# EAGLE design integratedBertha (EAGLE 6.6.0)
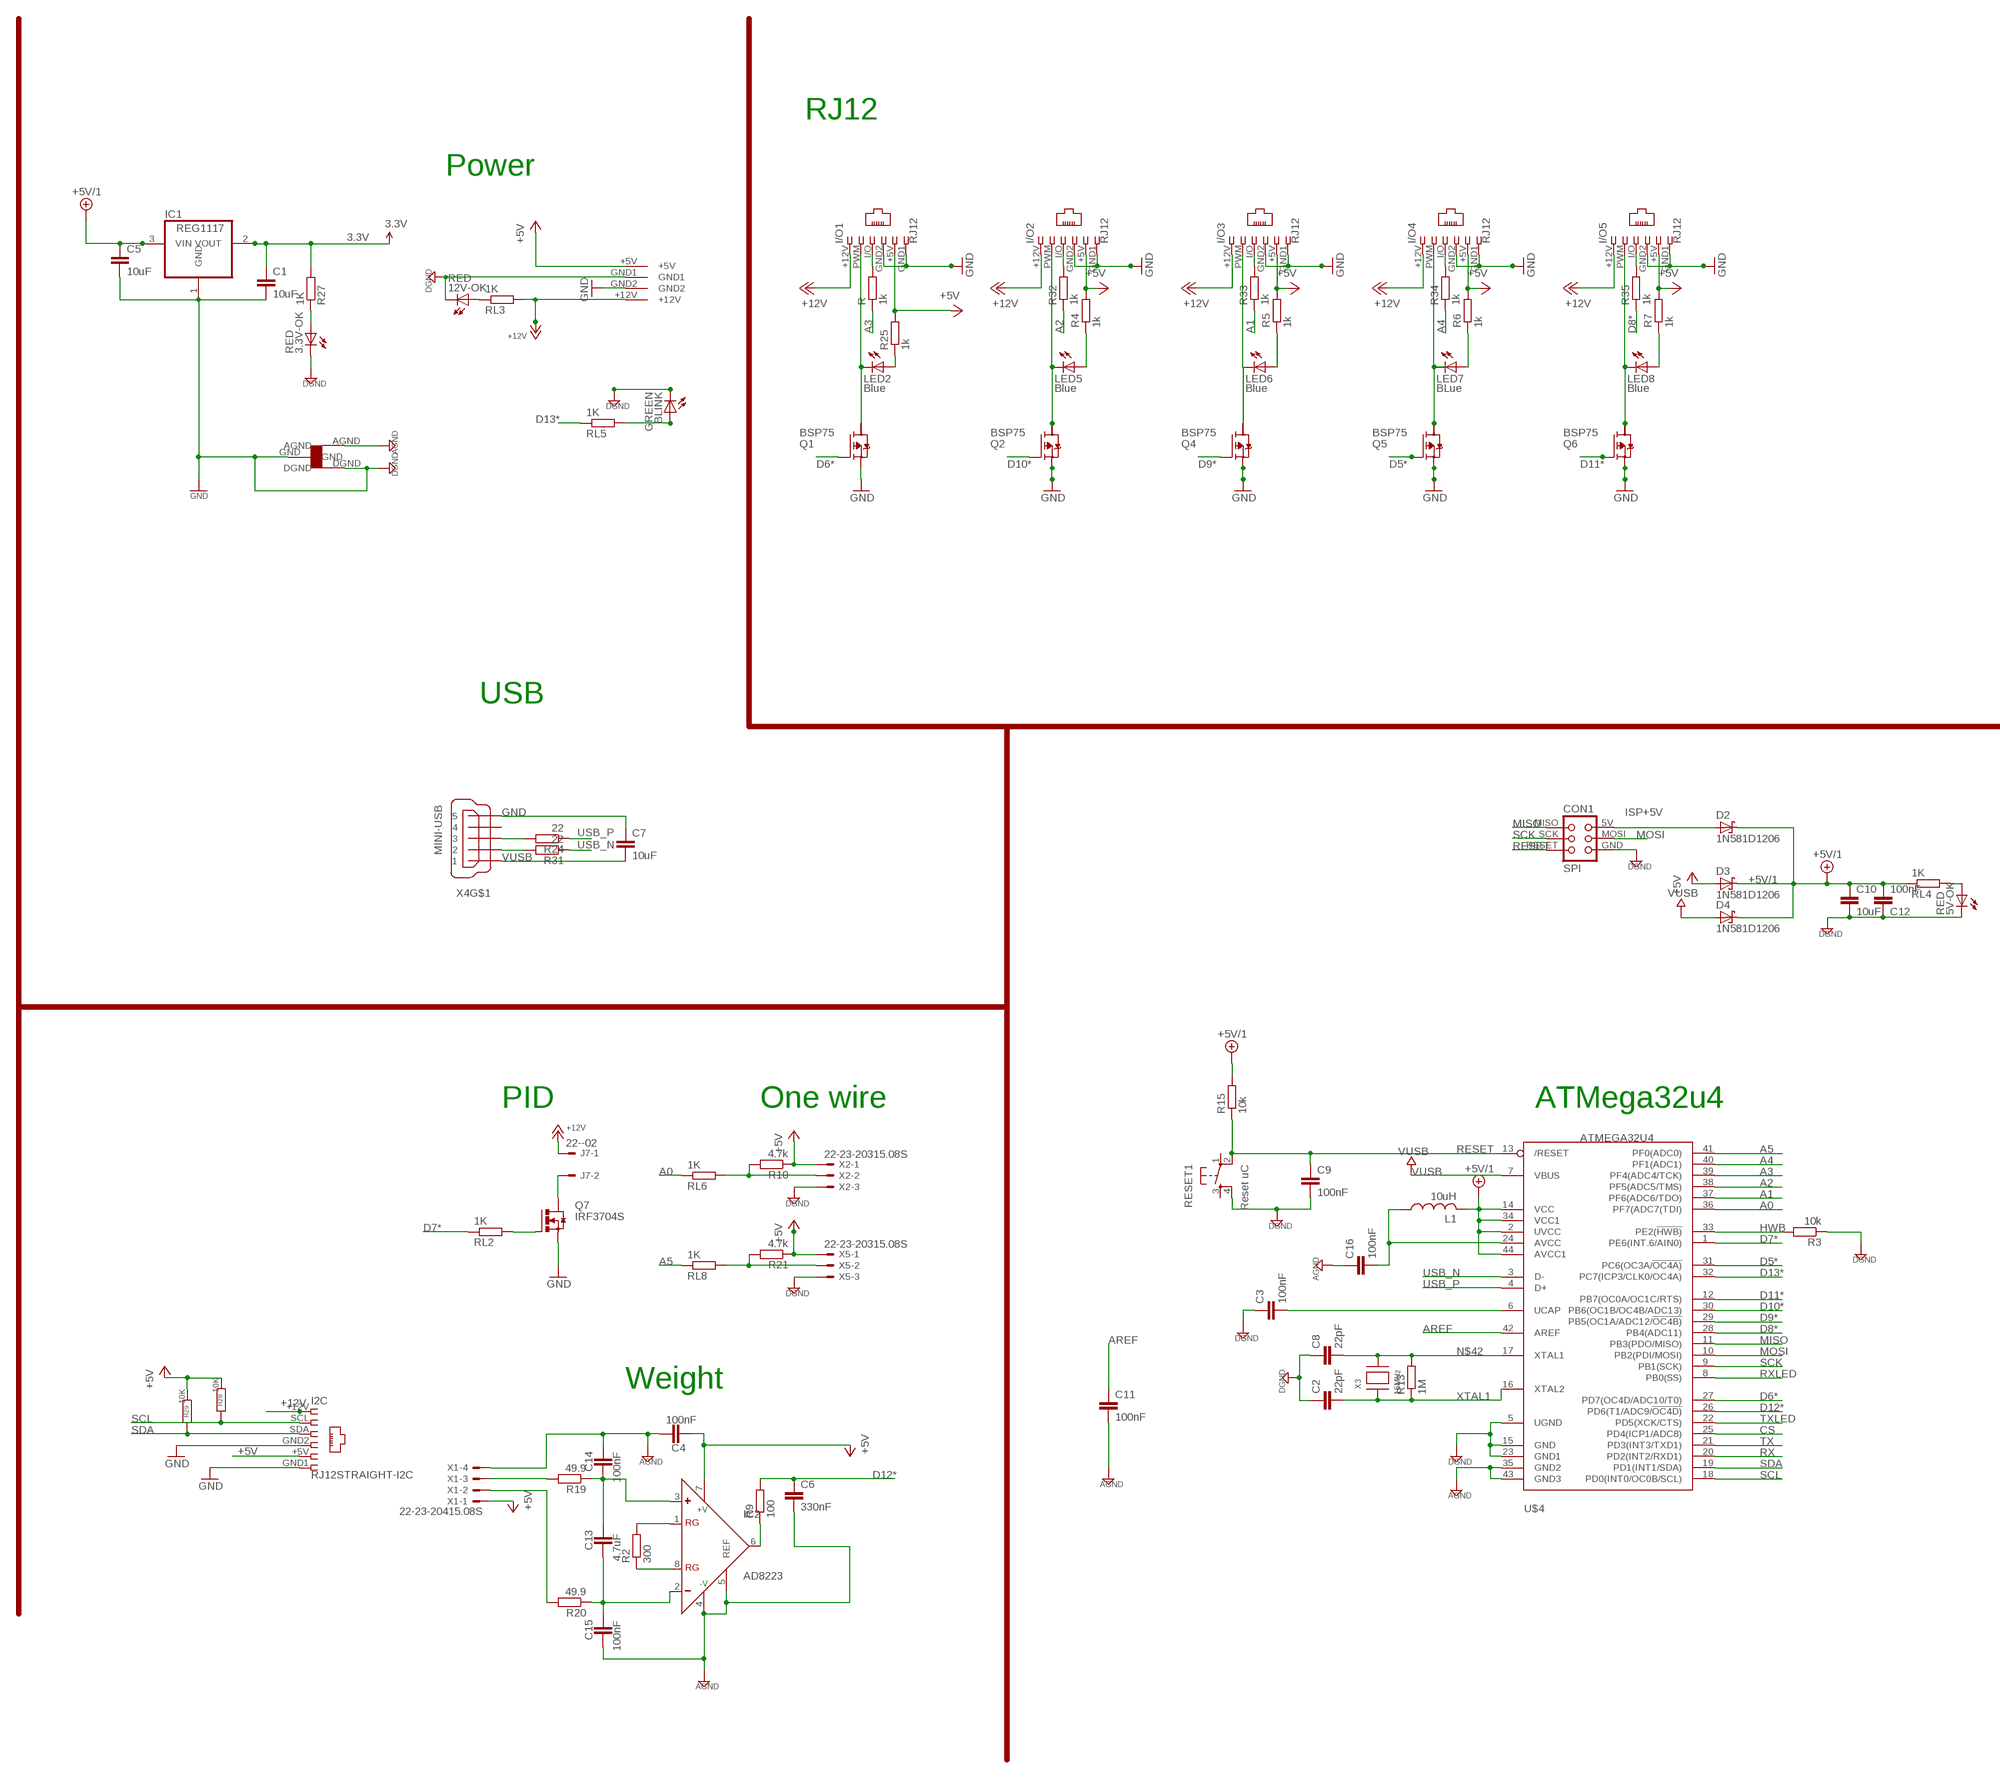
[diagram p0: schematic, sheet 1, part 1 of 2]
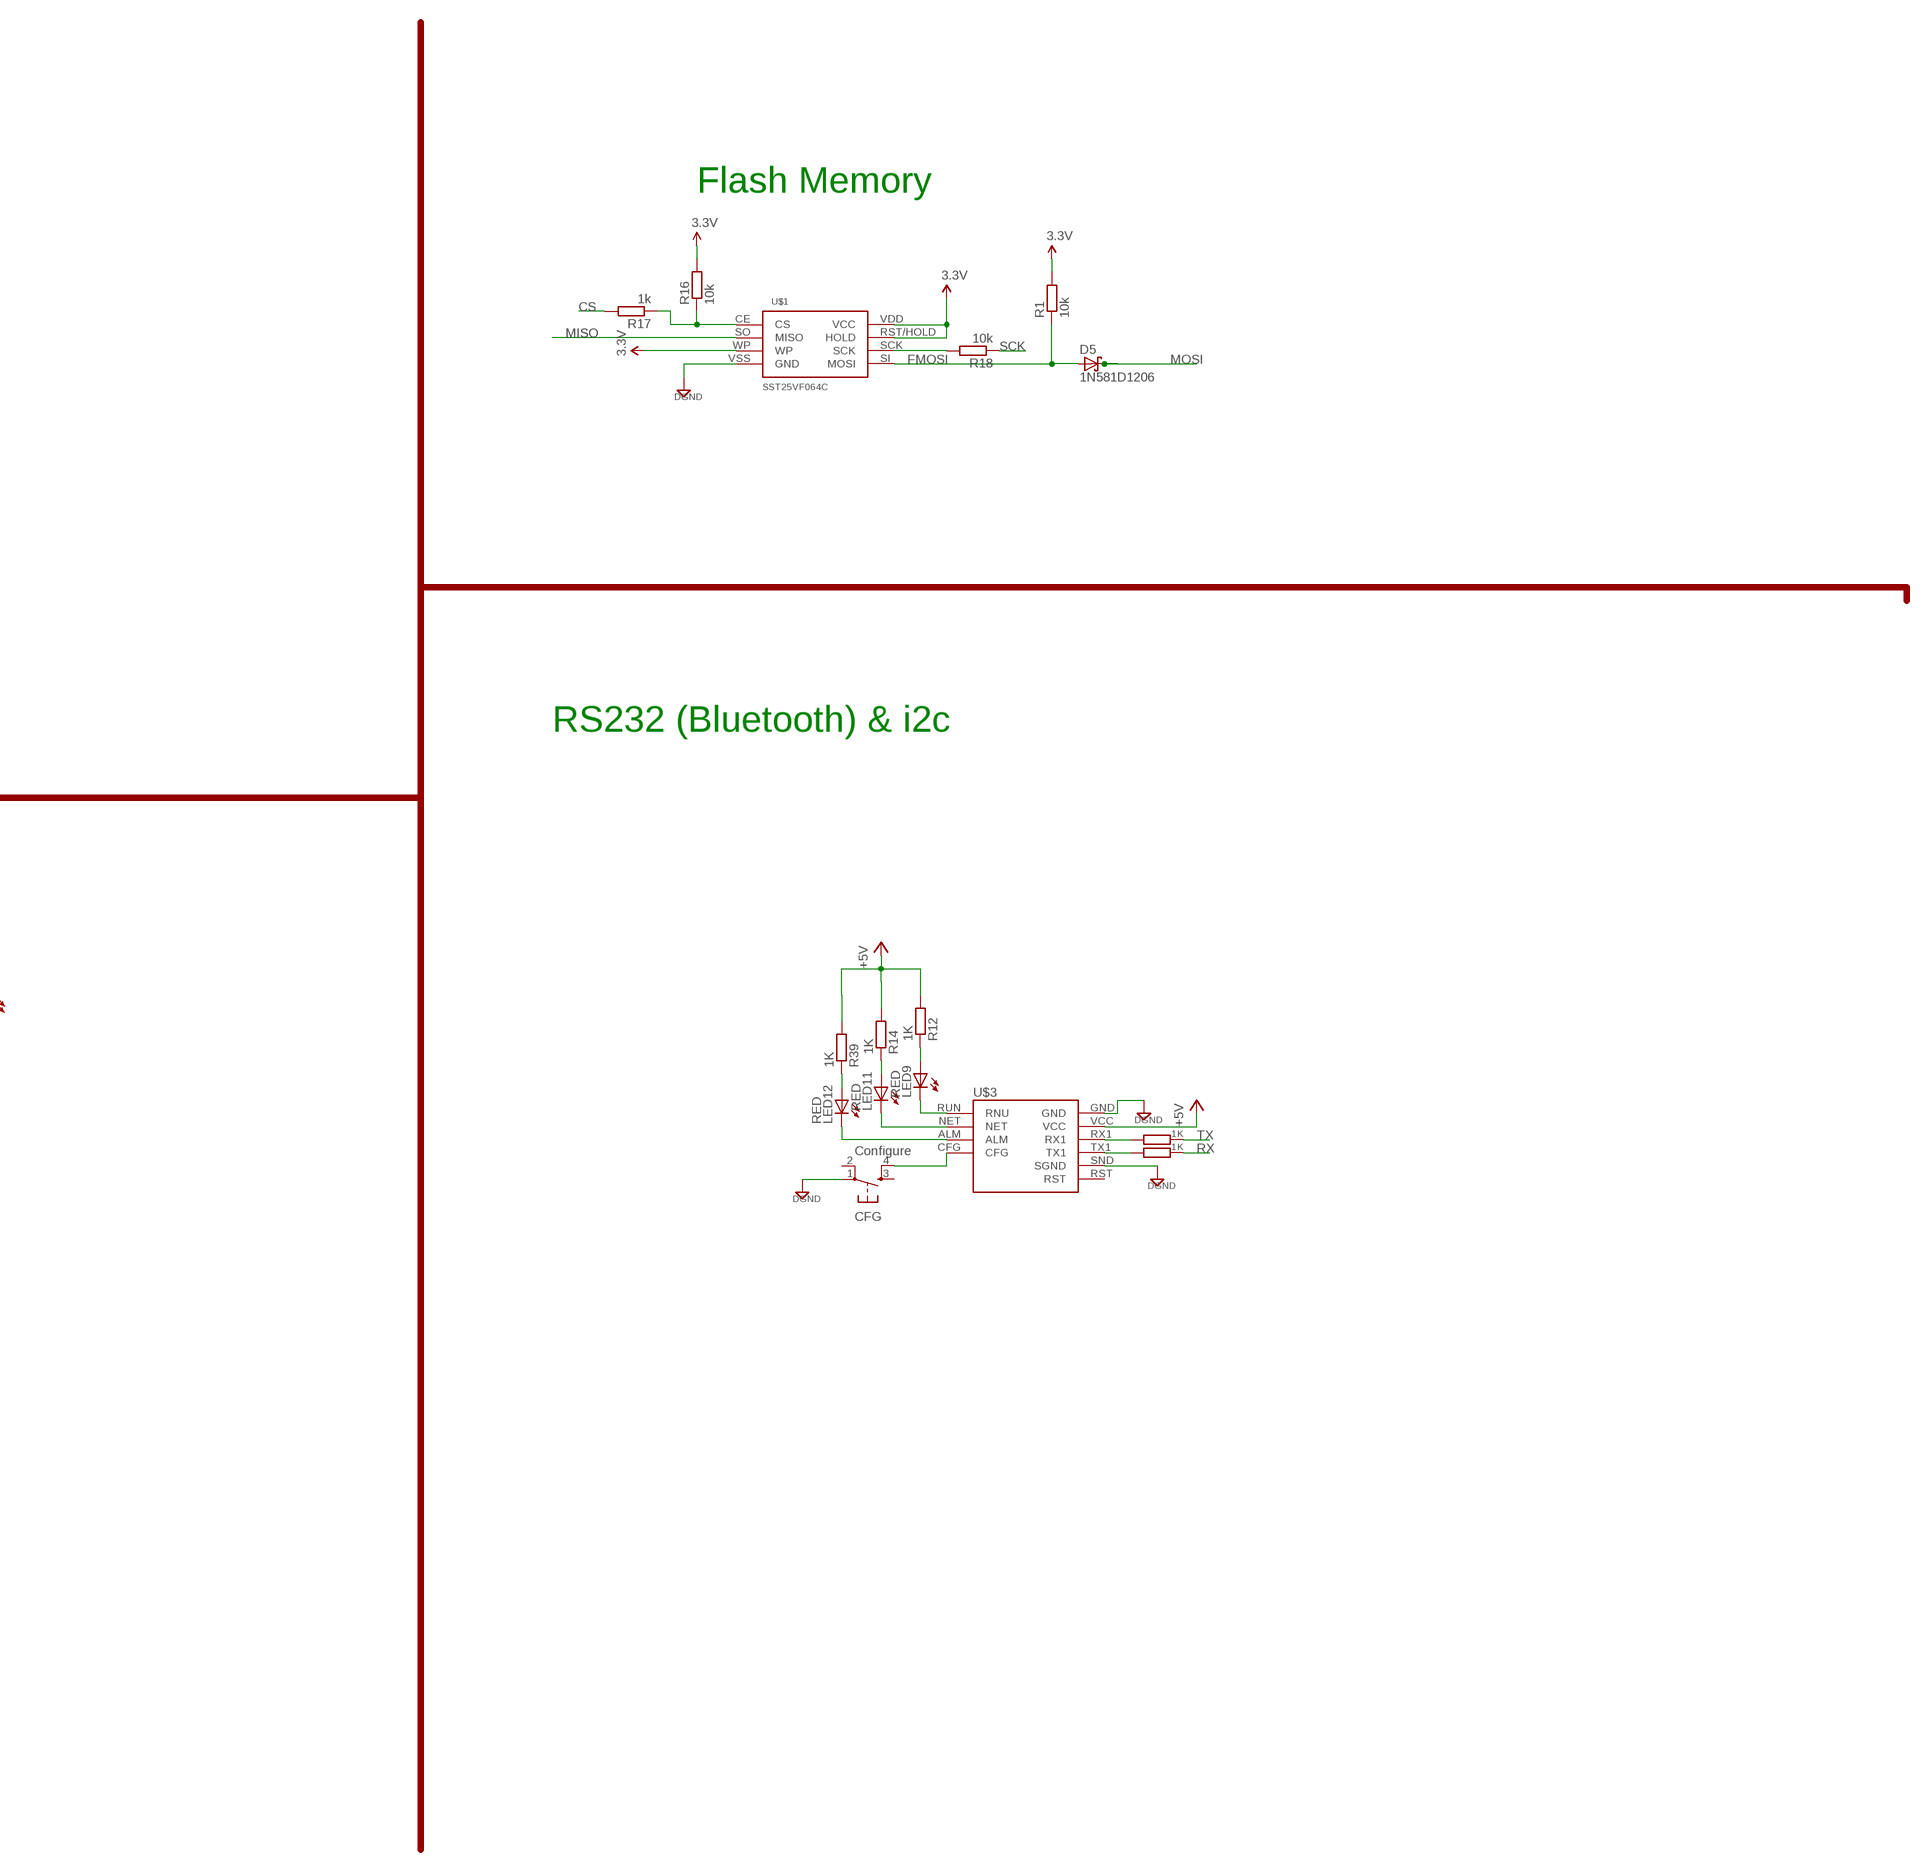
[diagram p1: schematic, sheet 1, part 2 of 2]

## Parts
3.3V-OK  RED  LEDCHIPLED_1206  [CHIPLED_1206]
5V-OK  RED  LEDCHIPLED_1206  [CHIPLED_1206]
12V-OK  RED  LEDCHIPLED_1206  [CHIPLED_1206]
BLINK  GREEN  LEDCHIPLED_1206  [CHIPLED_1206]
C1  10uF  C-EUC1206  [C1206]
C2  22pF  C-EUC1206  [C1206]
C3  100nF  C-EUC1206  [C1206]
C4  100nF  C-EUC1206  [C1206]
C5  10uF  C-EUC1206  [C1206]
C6  330nF  C-EUC1206  [C1206]
C7  10uF  C-EUC1206  [C1206]
C8  22pF  C-EUC1206  [C1206]
C9  100nF  C-EUC1206  [C1206]
C10  10uF  C-EUC1206  [C1206]
C11  100nF  C-EUC1206  [C1206]
C12  100nF  C-EUC1206  [C1206]
C13  4.7uF  C-EUC1206  [C1206]
C14  100nF  C-EUC1206  [C1206]
C15  100nF  C-EUC1206  [C1206]
C16  100nF  C-EUC1206  [C1206]
CFG  Configure  TAC_SWITCHSMD  [TACTILE_SWITCH_SMD]
CON1  SPI  TINYISPT  [TC2030-MCP-NL]
D2  1N581D1206  [LED-1206]
D3  1N581D1206  [LED-1206]
D4  1N581D1206  [LED-1206]
D5  1N581D1206  [LED-1206]
I2C  RJ12STRAIGHT-I2C  [RJ12-STRAIGHT-I2C]
I/O1  RJ12  RJ12STRAIGHT  [RJ12-STRAIGHT]
I/O2  RJ12  RJ12STRAIGHT  [RJ12-STRAIGHT]
I/O3  RJ12  RJ12STRAIGHT  [RJ12-STRAIGHT]
I/O4  RJ12  RJ12STRAIGHT  [RJ12-STRAIGHT]
I/O5  RJ12  RJ12STRAIGHT  [RJ12-STRAIGHT]
IC1  REG1117  [SOT223]
IC2  AD8223  AD620R  [SO8]
J7  22--02  [2-PIN-5.08S]
L1  10uH  L-USL2012C  [L2012C]
LED2  Blue  LEDCHIPLED_1206  [CHIPLED_1206]
LED5  Blue  LEDCHIPLED_1206  [CHIPLED_1206]
LED6  Blue  LEDCHIPLED_1206  [CHIPLED_1206]
LED7  BLue  LEDCHIPLED_1206  [CHIPLED_1206]
LED8  Blue  LEDCHIPLED_1206  [CHIPLED_1206]
LED9  RED  LEDCHIPLED_1206  [CHIPLED_1206]
LED11  RED  LEDCHIPLED_1206  [CHIPLED_1206]
LED12  RED  LEDCHIPLED_1206  [CHIPLED_1206]
Q1  BSP75  BSP613P  [PG-SOT-223]
Q2  BSP75  BSP613P  [PG-SOT-223]
Q4  BSP75  BSP613P  [PG-SOT-223]
Q5  BSP75  BSP613P  [PG-SOT-223]
Q6  BSP75  BSP613P  [PG-SOT-223]
Q7  IRF3704S  [D2PACK]
R  1k  R-EU_R0805  [R0805]
R1  10k  R-EU_R0805  [R0805]
R2  300  R-EU_R1206  [R1206]
R3  10k  R-EU_M0805  [M0805]
R4  1k  R-EU_R0805  [R0805]
R5  1k  R-EU_R0805  [R0805]
R6  1k  R-EU_R0805  [R0805]
R7  1k  R-EU_R0805  [R0805]
R8  1K  R-EU_R0805  [R0805]
R9  100  R-EU_R1206  [R1206]
R10  4.7k  R-EU_R1206  [R1206]
R11  1K  R-EU_R0805  [R0805]
R12  1K  R-EU_R0805  [R0805]
R13  1M  R-EU_R1206  [R1206]
R14  1K  R-EU_R0805  [R0805]
R15  10k  R-EU_M0805  [M0805]
R16  10k  R-EU_R0805  [R0805]
R17  1k  R-EU_R0805  [R0805]
R18  10k  R-EU_R0805  [R0805]
R19  49.9  R-EU_R1206  [R1206]
R20  49.9  R-EU_R1206  [R1206]
R21  4.7k  R-EU_R1206  [R1206]
R24  22  R-EU_M1206  [M1206]
R25  1k  R-EU_R0805  [R0805]
R27  1K  R-EU_R0805  [R0805]
R28  10K  R-EU_M0805  [M0805]
R29  10K  R-EU_M0805  [M0805]
R31  22  R-EU_M1206  [M1206]
R32  1k  R-EU_R0805  [R0805]
R33  1k  R-EU_R0805  [R0805]
R34  1k  R-EU_R0805  [R0805]
R35  1k  R-EU_R0805  [R0805]
R39  1K  R-EU_R0805  [R0805]
RESET1  Reset uC  TAC_SWITCHSMD  [TACTILE_SWITCH_SMD]
RL2  1K  R-EU_R0805  [R0805]
RL3  1K  R-EU_R0805  [R0805]
RL4  1K  R-EU_R0805  [R0805]
RL5  1K  R-EU_R0805  [R0805]
RL6  1K  R-EU_R0805  [R0805]
RL8  1K  R-EU_R0805  [R0805]
U$1  SST25VF064C  [SOIC_8-LEAD]
U$2  STARGND  [STAR]
U$3  SZ05-ZIGBEE  SZ05-ZIGBEETHROUGHHOLE  [SZ05-ZIGBEE4]
U$4  ATMEGA32U4  ATMEGA32U4-AU  [TQFP44]
U$6  KPJX-4S-S  [KPJX-4S-S]
X1  22-23-20415.08S  [4-PIN-5.08S]
X2  22-23-20315.08S  [3-PIN-5.08S]
X3  16MHz  XTALNX6035  [NX6035]
X4  MINI-USB  MINI-USB-SCHIELD-32005-201  [32005-201]
X5  22-23-20315.08S  [3-PIN-5.08S]

## Nets
3.3V [power]: C1.1 IC1.2(VOUT) R1.2 R16.2 R27.2 U$1.RST/HOLD(HOLD) U$1.VDD(VCC) U$1.WP
+5V [power]: C4.2 D3.A I2C.+5V I/O1.+5V I/O2.+5V I/O3.+5V I/O4.+5V I/O5.+5V IC2.7(+V) R4.2 R5.2 R6.2 R7.2 R10.1 R12.2 R14.2 R21.1 R25.2 R28.1 R29.1 R39.2 U$3.VCC U$6.+5V X1.1 X2.1 X5.1
+5V/1 [fine]: C5.1 C10.1 C12.2 D2.C D3.C D4.C IC1.3(VIN) L1.2 R15.2 RL4.1 U$4.2(UVCC) U$4.14(VCC) U$4.34(VCC1) U$4.44(AVCC1)
+12V [power]: I2C.+12V I/O1.+12V I/O2.+12V I/O3.+12V I/O4.+12V I/O5.+12V J7.1 RL3.2 U$6.+12V
A0: RL6.1 U$4.36(PF7(ADC7(TDI))
A1: R33.1 U$4.37(PF6(ADC6/TDO))
A2: R32.1 U$4.38(PF5(ADC5/TMS))
A3: R.1 U$4.39(PF4(ADC4/TCK))
A4: R34.1 U$4.40(PF1(ADC1))
A5: RL8.1 U$4.41(PF0(ADC0))
AGND: C4.1 C6.2 C11.2 C14.1 C15.2 C16.1 IC2.4(-V) IC2.5(REF) U$2.AGND U$4.35(GND2) U$4.43(GND3) X1.4
AREF: C11.1 U$4.42(AREF)
CS: R17.2 U$4.25(PD4(ICP1/ADC8))
D5*: Q5.1(G) U$4.31(PC6(OC3A/!OC4A))
D6*: Q1.1(G) U$4.27(PD7(OC4D/ADC10/T0))
D7*: RL2.1 U$4.1(PE6(INT.6/AIN0))
D8*: R35.1 U$4.28(PB4(ADC11))
D9*: Q4.1(G) U$4.29(PB5(OC1A/ADC12/!OC4B))
D10*: Q2.1(G) U$4.30(PB6(OC1B/OC4B/ADC13))
D11*: Q6.1(G) U$4.12(PB7(OC0A/OC1C/RTS))
D12*: C6.1 R9.2 U$4.26(PD6(T1/ADC9/!OC4D))
D13*: RL5.1 U$4.32(PC7(ICP3/CLK0/OC4A))
DIFF+: C13.1 C14.2 IC2.3(+) R19.1
DIFF-: C13.2 C15.1 IC2.2(-) R20.1
FMOSI: D5.A R1.1 U$1.SI(MOSI)
GND [power]: 3.3V-OK.C 5V-OK.C 12V-OK.C BLINK.C C1.2 C2.1 C3.1 C5.2 C7.1 C8.1 C9.2 C10.2 C12.1 CFG.1 CON1.GND I2C.GND1 I2C.GND2 I/O1.GND1 I/O1.GND2 I/O2.GND1 I/O2.GND2 I/O3.GND1 I/O3.GND2 I/O4.GND1 I/O4.GND2 I/O5.GND1 I/O5.GND2 IC1.1(GND) Q1.3(S) Q2.3(S) Q4.3(S) Q5.3(S) Q6.3(S) Q7.3(S) R3.1 RESET1.4 U$1.VSS(GND) U$2.DGND U$2.GND U$3.GND U$3.SND(SGND) U$4.5(UGND) U$4.15(GND) U$4.23(GND1) U$6.GND1 U$6.GND2 X2.3 X4.5 X5.3 ; supply symbol labelled DGND
GND1 [VIN]: LED9.C U$3.RUN(RNU)
GND2 [VIN]: LED11.C U$3.NET
GND3 [VIN]: LED12.C U$3.ALM
HWB: R3.2 U$4.33(PE2(!HWB))
ISP+5V: CON1.5V(VCC) D2.A
MISO: CON1.MISO U$1.SO(MISO) U$4.11(PB3(PDO/MISO))
MOSI: CON1.MOSI D5.C U$4.10(PB2(PDI/MOSI))
N$1: I/O3.PWM LED6.C Q4.2(D)
N$2: I/O2.I/O R32.2
N$3: BLINK.A RL5.2
N$4: LED5.A R4.1
N$5: I/O4.PWM LED7.C Q5.2(D)
N$6: Q7.1(G) RL2.2
N$7: I/O3.I/O R33.2
N$9 [power]: R21.2 RL8.2 X5.2
N$10: R16.1 R17.1 U$1.CE(CS)
N$11: R11.2 U$3.RX1
N$12: 5V-OK.A RL4.2
N$13: IC2.1(RG) R2.2
N$14 [fine]: C16.2 L1.1 U$4.24(AVCC)
N$15: IC2.8(RG) R2.1
N$16: C3.2 U$4.6(UCAP)
N$17: LED2.A R25.1
N$18: I/O1.I/O R.2
N$19: I/O5.PWM LED8.C Q6.2(D)
N$20: 3.3V-OK.A R27.1
N$21 [power]: R10.2 RL6.2 X2.2
N$22: LED6.A R5.1
N$23: R18.2 U$1.SCK
N$24: R8.2 U$3.TX1
N$25: LED9.A R12.1
N$26: LED11.A R14.1
N$27: LED12.A R39.1
N$28: I/O2.PWM LED5.C Q2.2(D)
N$29: I/O4.I/O R34.2
N$30: LED7.A R6.1
N$31: R20.2 X1.2
N$32: I/O5.I/O R35.2
N$33: LED8.A R7.1
N$34: I/O1.PWM LED2.C Q1.2(D)
N$35: CFG.4 U$3.CFG
N$36: J7.2 Q7.2(D)
N$37: R19.2 X1.3
N$40: IC2.6(OUT) R9.1
N$42: C8.2 R13.2 U$4.17(XTAL1) X3.P$2
N$75: 12V-OK.A RL3.1
RESET: C9.1 CON1.RESET R15.1 RESET1.2 U$4.13(/RESET)
RX: R8.1 U$4.20(PD2(INT2/RXD1))
RXLED: U$4.8(PB0(SS))
SCK: CON1.SCK R18.1 U$4.9(PB1(SCK))
SCL: I2C.SCL R28.2 U$4.18(PD0(INT0/OC0B/SCL))
SDA: I2C.SDA R29.2 U$4.19(PD1(INT1/SDA))
TX: R11.1 U$4.21(PD3(INT3/TXD1))
TXLED: U$4.22(PD5(XCK/CTS))
USB_N: R31.1 U$4.3(D-)
USB_P: R24.1 U$4.4(D+)
USBC_N: R31.2 X4.2
USBC_P: R24.2 X4.3
VUSB: C7.2 D4.A U$4.7(VBUS) X4.1
XTAL1: C2.2 R13.1 U$4.16(XTAL2) X3.P$1
Unconnected: CFG.2 CFG.3 Q1.4(D) Q2.4(D) Q4.4(D) Q5.4(D) Q6.4(D) RESET1.1 RESET1.3 U$3.RST X4.4 X4.M1(S:S1) X4.M2(S:S2) X4.M3(S:S3) X4.M4(S:S4)

## Notes on the sheet
- RJ12
- Power
- Flash Memory
- RS232 (Bluetooth) & i2c
- USB
- PID | One wire | ATMega32u4
- Weight

## Library data of the parts
3.3V-OK 5V-OK 12V-OK BLINK LED2 LED5-LED9 LED11 LED12 = adafruit:LED: LED OSRAM: - CHIPLED LG R971, LG N971, LY N971, LG Q971, LY Q971, LO R971, LY R971 LH N974, LH R974 LS Q976, LO Q976, LY Q976 LO Q996 - Hyper CHIPLED LW Q18S LB Q993, LB Q99A, LB R99A - SideLED LS A670, LO A670, LY A670, LG A670, LP A670 LB A673, LV A673, LT A673, LW A673 LH A674 LY A675 LS A676, LA A676, LO A676, LY A676, LW A676 LS A679, LY A679, LG A679 - Hyper Micro SIDELED® LS Y876, LA Y876, LO Y876, LY Y876 LT Y87S - SmartLED LW L88C, LW L88S LB L89C, LB L89S, LG L890 LS L89K, LO L89K, LY L89K LS L896, LA L896, LO L896, LY L896 - TOPLED LS T670, LO T670, LY T670, LG T670, LP T670 LSG T670, LSP T670, LSY T670, LOP T670, LYG T670 LG T671, LOG T671, LSG T671 LB T673, LV T673, LT T673, LW T673 LH T674 LS T676, LA T676, LO T676, LY T676, LB T676, LH T676, LSB T676, LW T676 LB T67C, LV T67C, LT T67C, LS T67K, LO T67K, LY T67K, LW E67C LS E67B, LA E67B, LO E67B, LY E67B, LB E67C, LV E67C, LT E67C LW T67C LS T679, LY T679, LG T679 LS T770, LO T770, LY T770, LG T770, LP T770 LB T773, LV T773, LT T773, LW T773 LH T774 LS E675, LA E675, LY E675, LS T675 LS T776, LA T776, LO T776, LY T776, LB T776 LHGB T686 LT T68C, LB T68C - Hyper Mini TOPLED® LB M676 - Mini TOPLED Santana® LG M470 LS M47K, LO M47K, LY M47K Source: http://www.osram.convergy.de/
C1-C16 = rcl:C-EU: CAPACITOR, European symbol
CFG RESET1 = lpatiny:TAC_SWITCH: Momentary Switch Button commonly used for reset or general input. Spark Fun Electronics SKU : COM-00097
CON1 = lpatiny:TINYISP: CONNECTOR
D2-D5 = lpatiny:1N581*: 1.0A SCHOTTKY BARRIER RECTIFIER Source: http://www.diodes.com/datasheets/ds23001.pdf
I2C I/O1-I/O5 = lpatiny:RJ12: CORCOM Modular RJ Jacks No Shield Source: www.tycoelectronics.com .. ENG_DS_1654001_1099_RJ_L_0507.pdf
IC1 = burr-brown:REG1117: 800mA and 1A Low Dropout (LDO) Positive Regulator 1.8V, 2.5V, 2.85V, 3.3V, 5V, and Adj; MPN: REG1117; OC_FARNELL: 1097566; OC_NEWARK: 14P6981
IC2 = analog-devices:AD620: Low Cost, Low Power, Instrumentation Amplifier Source: http://www.analog.com/UploadedFiles/Data_Sheets/37793330023930AD620_e.pdf; MPN: AD620AR; OC_FARNELL: 1464424; OC_NEWARK: 05F7109
J7 = lpatiny:22-?-02: CONNECTOR wire to board 2.54 mm (.1 inch) pitch header
L1 = rcl:L-US: INDUCTOR, American symbol
Q1 Q2 Q4-Q6 = infineon:BSP613P: SIPMOS (R) Small-Signal-Transistor P-Channel (2 Drain) Source: http://www.infineon.com/dgdl/BSP613P_Rev2.4.pdf; OC_FARNELL: unknown; OC_NEWARK: unknown
Q7 = transistor-power:IRF3704: SMPS MOSFET HEXFET® Power MOSFET Source: http://www.irf.com/product-info/datasheets/data/irf3704.pdf
R R1 R4-R8 R11-R14 R16-R18 R25 R27 R32-R35 R39 RL2 RL3 RL5 RL6 RL8 = rcl:R-EU_: RESISTOR, European symbol
R2 R3 R9 R10 R15 R19-R21 R24 R28 R29 R31 RL4 = resistor:R-EU_: RESISTOR, European symbol
U$1 = BertaLib:SST25VF064C
U$2 = lpatiny:STARGND
U$3 = lpatiny:SZ05-ZIGBEE
U$4 = adafruit:ATMEGA32U4: http://www.ladyada.net/library/eagle
U$6 = lpatiny:KPJX-4S-S
X1 = lpatiny:22-23-2041: .100" (2.54mm) Center Header - 4 Pin
X2 X5 = lpatiny:22-23-2031: .100" (2.54mm) Center Header - 3 Pin
X3 = lpatiny:XTAL: Low cost SMT crystals, no capacitors included http://www.ladyada.net/library/eagle
X4 = con-cypressindustries:MINI-USB-SCHIELD-: MINI USB-B Conector Source: www.cypressindustries.com; OC_FARNELL: unknown; OC_NEWARK: unknown

## Net classes
0 default: width 0.305 mm
1 power: width 0.457 mm
2 VIN: width 0.457 mm
3 fine: width 0.254 mm
4 aref: width 0.305 mm

## Board
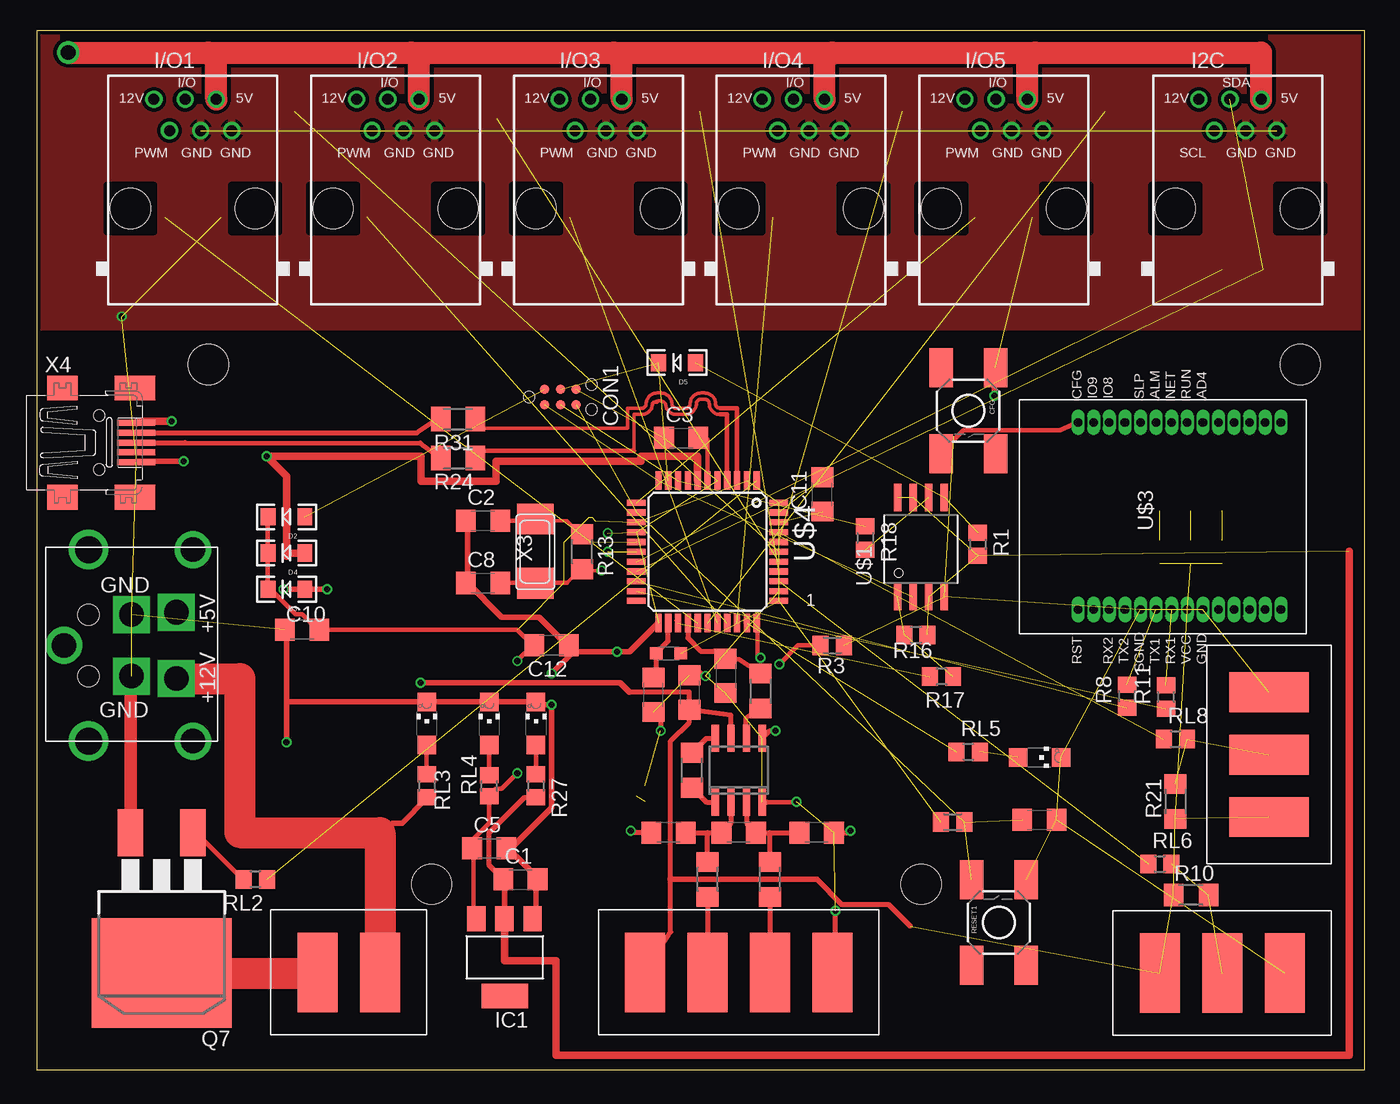
[diagram p2: board, top side]
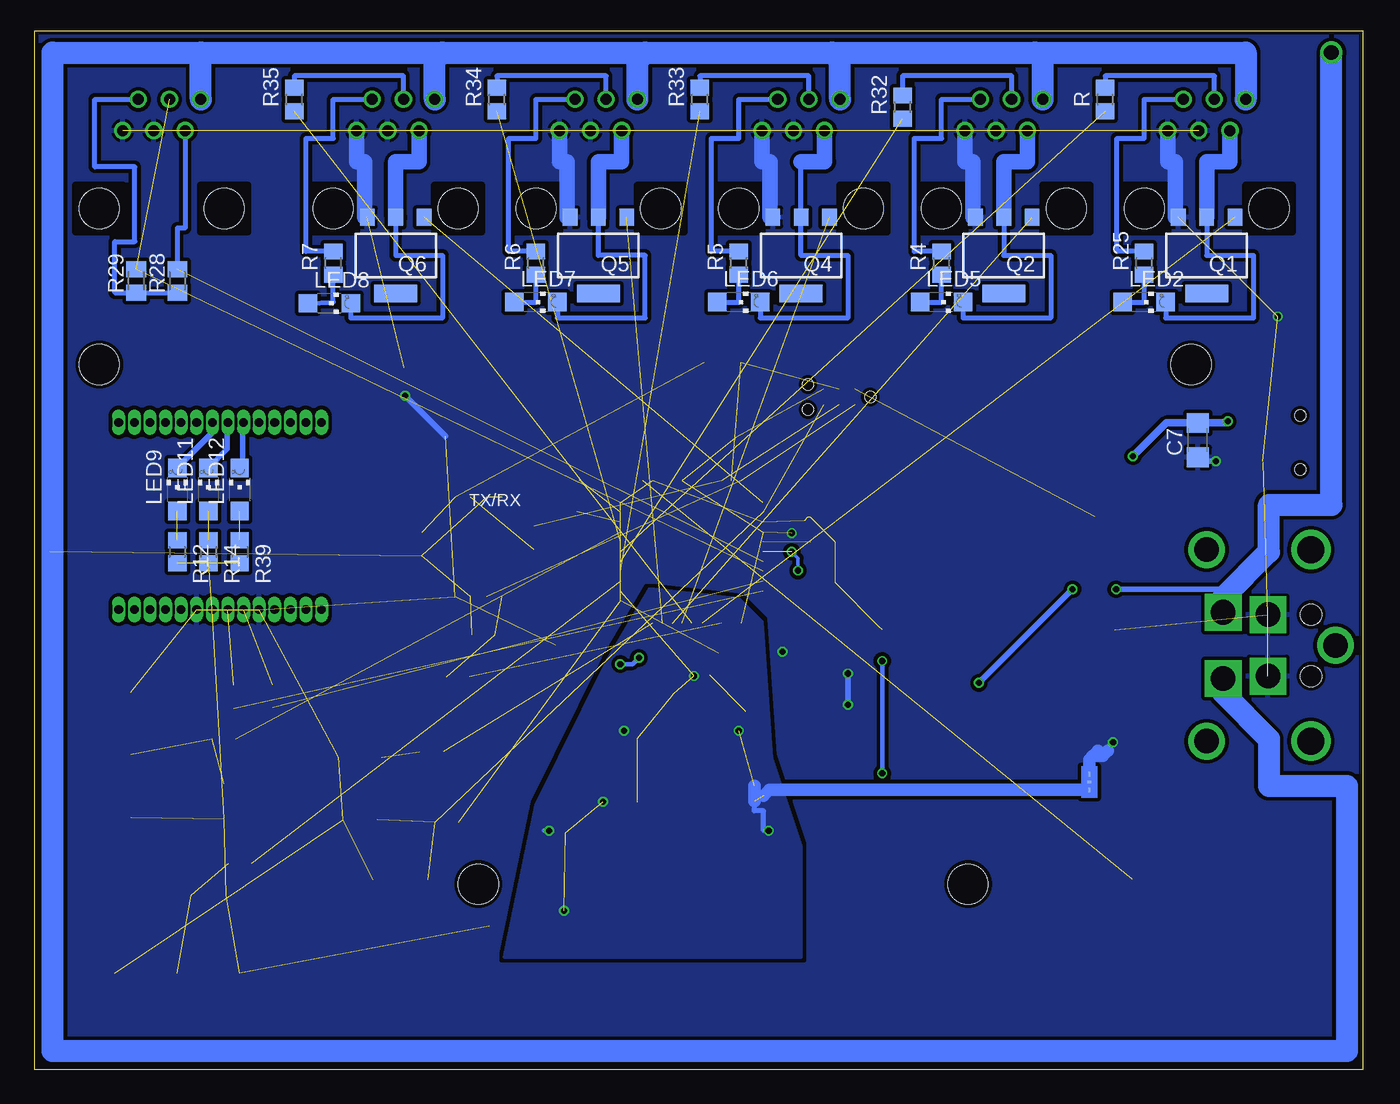
[diagram p3: board, bottom side, seen from below]

Size 108.13 x 84.57 mm. Coordinates in mm from the lower left corner, seen from the top.
Outline: 0,0 108.13,0 108.13,84.57 0,84.57 0,0
Copper layers (1*2*15*16): Top 0.035mm / dielectric 0.2mm / layer 2 0.0175mm / dielectric 1.1mm / layer 15 0.0175mm / dielectric 0.2mm / Bottom 0.035mm
Design rules "SeeedStudio_DRU_no_angle_20130527 *": minimum track width 6mil, minimum drill 0.5mm, track to track 7.5mil, track to pad 7.5mil, pad to pad 7.5mil, via to via 7.5mil, smd to smd 0mil, copper to edge 10mil, drill to drill 10mil, minimum pad ring 6mil, minimum via ring 6mil, stop-mask expansion 2mil, vias tented up to drill 25mil, thermal gap 10mil
Holes 3.25 mm at 13.97,57.4 102.87,57.4 32.13,15.11 72.01,15.11
vRestrict: area 47,34.5 to 62.2,38.4; area 47,35.8 to 50.8,49.8; area 58.4,37.1 to 62.2,49.8; area 47,46 to 62.2,49.8

### Footprints (pad centres in the part's own frame; a part is rotated, then mirrored left to right if it is on the bottom)
CHIPLED_1206 = smd 1.5 x 1.5: A 0,-1.75; C 0,1.75
C1206 = smd 1.6 x 1.8: 1 -1.4,0; 2 1.4,0
TACTILE_SWITCH_SMD = smd 3.175 x 1.905: 1 -3.493,2.223; 2 3.493,2.223; 3 -3.493,-2.223; 4 3.493,-2.223
TC2030-MCP-NL = smd 0.787 x 0.787: 5V 1.27,0.635; GND 3.81,0.635; MISO 1.27,-0.635; MOSI 2.54,0.635; RESET 3.81,-0.635; SCK 2.54,-0.635 | hole 0.889: 0,0; 5.08,-1.016; 5.08,1.016
LED-1206 = smd 1.2 x 1.4: A -1.5,0; C 1.5,0
RJ12-STRAIGHT-I2C = drill 0.9 pad 1.4: +5V 1.905,8.89; +12V -3.175,8.89; GND1 3.175,6.35; GND2 0.635,6.35; SCL -1.905,6.35; SDA -0.635,8.89 | hole 3.251: -5.08,0; 5.08,0
RJ12-STRAIGHT = drill 0.9 pad 1.4: +5V 1.905,8.89; +12V -3.175,8.89; GND1 3.175,6.35; GND2 0.635,6.35; I/O -0.635,8.89; PWM -1.905,6.35 | hole 3.251: -5.08,0; 5.08,0
SOT223 = smd 1.499 x 2.007: 1 -2.261,-3.15; 2 0.025,-3.15; 3 2.311,-3.15 | smd 3.81 x 2.007: 4 0,3.15
SO8 = smd 0.6 x 2.2: 1 -1.905,-2.6; 2 -0.635,-2.6; 3 0.635,-2.6; 4 1.905,-2.6; 5 1.905,2.6; 6 0.635,2.6; 7 -0.635,2.6; 8 -1.905,2.6
2-PIN-5.08S = smd 3.251 x 6.452: 1 -2.54,0; 2 2.54,0
L2012C = smd 1 x 1: 1 -1,0; 2 1,0
PG-SOT-223 = smd 1.2 x 1.4: 1 -2.311,-3.099; 2 0,-3.099; 3 2.311,-3.099 | smd 3.5 x 1.4: 4 0,3.099
D2PACK = smd 2.083 x 3.81: 1 -2.54,-8.89; 3 2.54,-8.89 | smd 11.43 x 8.89: 2 0,2.54
R0805 = smd 1.3 x 1.5: 1 -0.95,0; 2 0.95,0
R1206 = smd 1.6 x 1.803: 1 -1.422,0; 2 1.422,0
M0805 = smd 1.3 x 1.6: 1 -0.95,0; 2 0.95,0
M1206 = smd 1.6 x 2: 1 -1.4,0; 2 1.4,0
R0805' = smd 1.3 x 1.5: 1 -0.85,0; 2 0.85,0
SOIC_8-LEAD = smd 0.61 x 2.21: CE -1.905,-2.934; RST/HOLD -0.635,5.156; SCK 0.635,5.156; SI 1.905,5.156; SO -0.635,-2.934; VDD -1.905,5.156; VSS 1.905,-2.934; WP 0.635,-2.934
STAR = smd 0.152 x 0.305: AGND 0.635,-0.635; DGND 0.635,0.635 | smd 0.305 x 0.152: GND 0.635,0
SZ05-ZIGBEE4 = drill 0.7 pad 1.016 long: AD1 -6.985,6.35; AD2 -6.985,5.08; AD3 -6.985,3.81; AD4 -6.985,2.54; ALM -6.985,-1.27; C485 -6.985,-3.81; CFG -6.985,-7.62; GND 8.255,2.54; IO1 -6.985,8.89; IO2 -6.985,7.62; IO3 8.255,8.89; IO4 8.255,7.62; IO5 8.255,6.35; IO6 8.255,5.08; IO7 8.255,3.81; IO8 -6.985,-5.08; IO9 -6.985,-6.35; MS 8.255,-6.35; NET -6.985,0; RST 8.255,-7.62; RUN -6.985,1.27; RX1 8.255,0; RX2 8.255,-5.08; SLD -6.985,-2.54; SND 8.255,-2.54; TX1 8.255,-1.27; TX2 8.255,-3.81; VCC 8.255,1.27
TQFP44 = smd 1.5 x 0.5: 1 -5.8,4; 2 -5.8,3.2; 3 -5.8,2.4; 4 -5.8,1.6; 5 -5.8,0.8; 6 -5.8,0; 7 -5.8,-0.8; 8 -5.8,-1.6; 9 -5.8,-2.4; 10 -5.8,-3.2; 11 -5.8,-4; 23 5.8,-4; 24 5.8,-3.2; 25 5.8,-2.4; 26 5.8,-1.6; 27 5.8,-0.8; 28 5.8,0; 29 5.8,0.8; 30 5.8,1.6; 31 5.8,2.4; 32 5.8,3.2; 33 5.8,4 | smd 0.5 x 1.5: 12 -4,-5.8; 13 -3.2,-5.8; 14 -2.4,-5.8; 15 -1.6,-5.8; 16 -0.8,-5.8; 17 0,-5.8; 18 0.8,-5.8; 19 1.6,-5.8; 20 2.4,-5.8; 21 3.2,-5.8; 22 4,-5.8; 34 4,5.8; 35 3.2,5.8; 36 2.4,5.8; 37 1.6,5.8; 38 0.8,5.8; 39 0,5.8; 40 -0.8,5.8; 41 -1.6,5.8; 42 -2.4,5.8; 43 -3.2,5.8; 44 -4,5.8
KPJX-4S-S = drill 2 square: +5V 2.7,1.35; +12V -2.7,1.35; GND1 -2.5,5; GND2 2.5,5 | drill 2: P$1 -7.8,0; P$2 7.8,0; P$11 0,10.5 | drill 2.2: P$3 -7.8,8.5; P$4 7.8,8.5 | hole 1.7: -2.5,8.5; 2.5,8.5
4-PIN-5.08S = smd 3.251 x 6.452: 1 -7.62,0; 2 -2.54,0; 3 2.54,0; 4 7.62,0
3-PIN-5.08S = smd 3.251 x 6.452: 1 -5.08,0; 2 0,0; 3 5.08,0
NX6035 = smd 2.5 x 3: P$1 2.665,0; P$2 -2.565,0
32005-201 = smd 3.1 x 0.5: 1 3,1.6; 2 3,0.8; 3 3,0; 4 3,-0.8; 5 3,-1.6 | smd 2.5 x 2: M1 -3,-4.45; M2 -3,4.45 | smd 3.3 x 2: M3 2.9,4.45; M4 2.9,-4.45 | hole 0.9: 0,2.2; 0,-2.2

### Placement (x,y rotation side)
3.3V-OK  40.64,28.19 0 top
5V-OK  36.83,28.19 0 top
12V-OK  31.75,28.19 0 top
BLINK  81.64,25.43 270 top
C1  39.37,15.49 0 top
C2  36.32,44.7 0 top
C3  52.46,51.43 0 top
C4  53.14,30.71 270 top
C5  36.83,18.03 0 top
C6  56.08,32.05 270 top
C7  13.41,51.26 90 bottom
C8  36.32,39.62 0 top
C9  81.64,20.35 0 top
C10  21.59,35.81 180 top
C11  63.96,46.84 90 top
C12  41.91,34.54 180 top
C13  57.15,19.3 180 top
C14  63.5,19.3 180 top
C15  51.44,19.3 180 top
C16  50.22,30.53 90 top
CFG  75.84,53.64 270 top
CON1  40.08,54.76 0 top
D2  20.32,45.01 180 top
D3  20.32,39.12 180 top
D4  20.32,42.06 180 top
D5  52.12,57.56 180 top
I2C  97.79,70.1 0 top
I/O1  12.7,70.1 0 top
I/O2  29.21,70.1 0 top
I/O3  45.72,70.1 0 top
I/O4  62.23,70.1 0 top
I/O5  78.74,70.1 0 top
IC1  38.1,9.14 180 top
IC2  57.15,24.38 0 top
J7  25.4,7.92 180 top
L1  51.44,33.91 0 top
LED2  17.78,62.48 270 bottom
LED5  34.29,62.48 270 bottom
LED6  50.8,62.48 270 bottom
LED7  67.31,62.48 270 bottom
LED8  84.14,62.4 270 bottom
LED9  96.52,47.24 0 bottom
LED11  93.98,47.24 0 bottom
LED12  91.44,47.24 0 bottom
Q1  12.7,66.29 180 bottom
Q2  29.21,66.29 180 bottom
Q4  45.72,66.29 180 bottom
Q5  62.23,66.29 180 bottom
Q6  78.74,66.29 180 bottom
Q7  10.16,10.41 180 top
R  20.95,78.99 90 bottom
R1  76.61,42.77 270 top
R2  53.34,24.38 270 top
R3  64.77,34.54 180 top
R4  34.29,65.66 90 bottom
R5  50.8,65.66 90 bottom
R6  67.31,65.66 90 bottom
R7  83.82,65.66 90 bottom
R8  88.77,30.4 90 top
R9  58.93,30.84 90 top
R10  93.98,14.22 0 top
R11  91.95,30.35 90 top
R12  96.52,42.16 270 bottom
R13  44.4,42.16 270 top
R14  93.98,42.16 270 bottom
R15  74.57,20.17 180 top
R16  71.58,35.41 0 top
R17  73.66,32 180 top
R18  67.46,43.28 270 top
R19  59.69,15.49 270 top
R20  54.61,15.49 270 top
R21  92.71,21.84 90 top
R24  34.29,49.78 180 top
R25  17.78,65.66 90 bottom
R27  40.64,23.11 270 top
R28  96.52,64.21 90 bottom
R29  99.87,64.21 90 bottom
R31  34.29,52.96 180 top
R32  37.47,78.36 90 bottom
R33  53.98,78.99 90 bottom
R34  70.48,78.99 90 bottom
R35  87,78.99 90 bottom
R39  91.44,42.16 270 bottom
RESET1  78.33,11.99 90 top
RL2  17.78,15.49 180 top
RL3  31.75,23.11 270 top
RL4  1K  [R0805']  36.83,23.11 90 top
RL5  75.84,25.88 0 top
RL6  91.44,16.76 0 top
RL8  92.71,26.92 0 top
U$1  71.98,41.43 0 top
U$2  22.89,23.42 0 bottom
U$3  92.41,45.72 270 top
U$4  54.61,42.16 270 top
U$6  12.7,34.54 90 top
X1  57.15,7.92 0 top
X2  96.52,7.87 0 top
X3  40.59,42.16 90 top
X4  5.08,51.05 0 top
X5  100.33,25.65 90 top

### Tracks (layer width: path | path; a pad name or v marks a point on that pad's centre or on a via)
3.3V  (5 unrouted)
  Top 0.406: C1.1 36.83,16.63 36.83,19.3 39.69,22.16 R27.2
  Top 0.457: C1.1 38.1,15.49 38.1,12.45 IC1.2
  Top 0.61: IC1.2 38.08,8.89 42.27,8.89 42.27,1.17 106.88,1.17 106.88,42.21
+5V  (via drill 0.5, 1.2)  (8 unrouted)
  Top 0.406: IC2.7 56.52,28.88 C4.2 | C4.2 53.14,30.73 48.26,30.73 | X1.1 51.61,11.23 51.61,15.49 51.61,26.77 53.14,28.3 C4.2 | 65.53,13.46 69.34,13.46 71.12,11.68
  Top 0.457: v20.07,39.12 D3.A v23.62,39.12 | 48.26,30.73 47.5,31.5 v31.24,31.5 | 65.53,13.46 63.5,15.49 51.61,15.49 51.56,15.49
  Top 1.778: v2.54,82.8 13.97,82.8 | 13.97,82.8 30.48,82.8 | 30.48,82.8 46.99,82.8 | 46.99,82.8 64.77,82.8 | 64.77,82.8 81.28,82.8 | 81.28,82.8 99.69,82.8 I2C.+5V | I/O1.+5V 14.61,82.17 13.97,82.8 | I/O2.+5V 31.11,82.17 30.48,82.8 | I/O3.+5V 47.62,82.17 46.99,82.8 | I/O4.+5V 64.14,82.17 64.77,82.8 | I/O5.+5V 80.64,82.17 81.28,82.8
  Bottom 0.406: R25.2 20,66.61 20,75.82 17.78,75.82 17.78,78.99 I/O1.+5V | R4.2 36.51,66.61 36.51,75.82 34.29,75.82 34.29,78.99 I/O2.+5V | R5.2 53.02,66.61 53.02,75.82 50.8,75.82 50.8,78.99 I/O3.+5V | R6.2 69.53,66.61 69.53,75.82 67.31,75.82 67.31,78.99 I/O4.+5V | R7.2 86.04,66.61 86.04,75.82 83.82,75.82 83.82,78.99 I/O5.+5V | I2C.+5V 103.23,78.99 103.23,73.51 99.97,73.51 99.97,67.41 101.6,67.41 101.6,63.26 R29.1 R28.1
  Bottom 0.457: v20.07,39.12 11.68,39.12 11.35,38.43 | v23.62,39.12 v31.24,31.5
  Bottom 1.778: U$6.+5V 11.35,38.43 7.62,42.16 7.62,45.97 2.54,45.97 v2.54,82.8
+5V/1  (via drill 0.5)  (14 unrouted)
  Top 0.356: 35.56,18.03 35.56,18.8 36.83,20.07 RL4.1 36.83,22.35 37.34,22.86 37.85,22.86 v39.12,24.13 | 35.56,18.03 35.56,12.45 IC1.3 | 35.56,18.03 C5.1 | D2.C 18.8,44.96 18.8,42.16 D4.C 18.8,41.91 18.8,39.12 D3.C 19.05,39.12 21.08,37.08 21.59,37.08 22.86,35.81 C10.1 39.12,35.81 40.39,34.54 | 40.39,34.54 v39.12,33.27 | 40.39,34.54 C12.2
  Bottom 0.356: v39.12,33.27 v39.12,24.13
+12V
  Top 0.457: RL3.2 31.75,22.1 29.72,20.07 28.96,20.07 27.94,19.3
  Top 2.54: U$6.+12V 16.51,31.84 16.51,19.3 27.94,19.3 J7.1
  Bottom 1.778: 94.61,82.8 106.68,82.8 106.68,1.52 1.27,1.52 1.27,23.11 7.62,23.11 7.62,26.92 11.35,30.65 U$6.+12V | 94.61,82.8 74.93,82.8 | 74.93,82.8 58.42,82.8 | 58.42,82.8 43.18,82.8 | 43.18,82.8 26.67,82.8 | 26.67,82.8 9.53,82.8 I/O1.+12V | I/O3.+12V 42.55,82.17 43.18,82.8 | I/O4.+12V 59.05,82.17 58.42,82.8 | I/O5.+12V 75.56,82.17 74.93,82.8 | I/O2.+12V 26.04,82.17 26.67,82.8 | I2C.+12V 94.61,82.8
A0  (1 unrouted)
A1  (1 unrouted)
A2  (1 unrouted)
A3  (1 unrouted)
A4  (1 unrouted)
A5  (1 unrouted)
AGND  (via drill 0.5, 0.5 pad 0.41)  (11 unrouted)
  Top 0.356: 63.75,48.01 C11.2
  Top 0.406: C15.2 48.36,19.3 v48.36,19.46 | X1.4 65.02,9.14 v65.02,12.95 | C14.1 66.09,19.3 v66.24,19.46 | IC2.4 59.45,21.78 v61.85,21.82 | C4.1 53.65,32.62 v54.46,32.05 | IC2.5 59.66,27.58 v60.15,27.58 | C16.1 50.8,28.55 v50.8,27.58
  Bottom 0.406: v48.36,19.46 48.77,19.46 48.77,21.08 49.53,21.08 49.53,21.84 | v66.24,19.46 66.65,19.46
  Bottom 1.016: 49.53,23.11 49.53,21.84 | U$2.AGND 48.28,22.78 48.77,22.3
  pour Bottom (isolate 0.305): 45.72,9.14 69.85,9.14 67.31,21.54 61.54,33.2 58.01,39.17 50.8,38.35 48.9,36.45 48.13,25.37 45.72,18.16
AREF  (1 unrouted)
CS  (1 unrouted)
  Top 0.356: 52.07,36.58 U$4.25
D5*  (1 unrouted)
D6*  (1 unrouted)
D7*  (1 unrouted)
D8*  (1 unrouted)
D9*  (1 unrouted)
D10*  (1 unrouted)
D11*  (1 unrouted)
D12*
  Top 0.406: U$4.26 53.01,35.13 54.05,34.09 55.15,34.09 C6.1 57.17,33.4 R9.2
D13*  (1 unrouted)
  Top 0.356: 57.71,36.58 U$4.32
  Top 0.406: U$4.32 57.71,36.36
DIFF+
  Top 0.406: IC2.3 57.78,20.07 C13.1 59.69,19.3 | 59.69,19.3 C14.2 | R19.1 59.69,19.3
DIFF-
  Top 0.406: IC2.2 56.52,20.07 C13.2 54.61,19.3 | C15.1 54.61,19.3 | R20.1 54.61,19.3
FMOSI  (2 unrouted)
GND  (via drill 0.5)  (31 unrouted)
  Top 0.457: 35.05,39.62 35.05,44.7 C2.1 | U$4.23 50.55,36.32 48.26,34.04 v47.24,34.04 43.94,34.04 43.43,34.54 C12.1 | 35.05,39.62 37.85,36.83 40.89,36.83 43.18,34.54 C12.1 | 35.05,39.62 C8.1 | IC1.1 40.39,12.45 40.64,12.45 40.64,15.49 C1.2 40.89,15.49 38.35,18.03 C5.2 38.61,18.03 41.91,21.34 v41.91,29.72 40.64,29.72 3.3V-OK.C 40.64,29.97 36.83,29.97 | 36.83,29.97 31.75,29.97 | 36.83,29.97 5V-OK.C | v20.32,26.67 20.32,29.97 | 20.32,29.97 20.32,35.81 C10.2 | v11.94,49.53 8.13,49.53 X4.5 | 7.62,32 U$6.GND1 | 20.32,29.97 31.75,29.97 | 31.75,29.97 12V-OK.C | v41.91,32.26 43.69,34.04 C12.1 | v77.98,54.86 77.98,56.9 CFG.1
  Top 1.016: 7.62,32 Q7.3
  Bottom 0.457: v20.32,26.67 20.57,26.42 20.73,25.96 | v11.94,49.53 13.21,49.53 13.21,49.78 C7.1 | v41.91,29.72 v41.91,32.26 | 74.68,51.56 v77.98,54.86
  Bottom 1.016: U$2.GND U$2.DGND 22.25,25.25 21.95,25.55 | 21.95,25.55 21.13,25.55 20.73,25.96 | 21.95,25.55 21.54,25.96
  Bottom 1.27: Q2.3 31.75,69.39 31.75,73.91 32.38,73.91 I/O2.GND1 | Q4.3 48.26,69.39 48.26,73.91 48.9,73.91 I/O3.GND1 | Q5.3 64.77,69.39 64.77,73.91 65.41,73.91 I/O4.GND1 | Q6.3 81.28,69.39 81.28,73.91 81.92,73.91 I/O5.GND1 | Q1.3 15.24,69.39 15.24,73.91 15.88,73.91 I/O1.GND1
  other vias: 46.48,43.69 6.91,61.32
  pour Bottom (isolate 0.305, rank 2): 0,84.07 107.95,84.07 107.95,0.25 0,0.25
  pour Top (isolate 0.305, rank 2): 0,84.48 108.1,84.48 108.1,60.5 0,60.5
GND1
  Bottom 0.457: LED9.C 96.52,49.02 93.73,51.82 93.73,52.58 U$3.RUN
GND2
  Bottom 0.457: LED11.C 93.98,49.02 92.46,50.55 92.46,52.58 U$3.NET
GND3
  Bottom 0.457: LED12.C 91.44,49.02 91.19,49.28 91.19,52.58 U$3.ALM
HWB  (via drill 0.5)
  Top 0.356: v58.93,33.53 58.67,33.53 58.67,36.32 U$4.33 | v60.45,33.02 61.98,34.54 R3.2
  Bottom 0.356: v58.93,33.53 59.44,33.02 v60.45,33.02
ISP+5V  (1 unrouted)
MISO  (2 unrouted)
MOSI  (2 unrouted)
N$1
  Bottom 0.406: LED6.C 49.05,61.21 41.91,61.21 41.91,66.29 45.72,66.29 Q4.2 45.72,73.91
  Bottom 1.27: 45.72,73.91 43.81,73.91 I/O3.PWM
N$2
  Bottom 0.406: I/O2.I/O 28.57,80.9 37.47,80.9 R32.2
N$3  (1 unrouted)
N$4
  Bottom 0.406: LED5.A 34.29,62.48 R4.1
N$5
  Bottom 0.406: Q5.2 62.23,66.29 58.42,66.29 58.42,61.21 65.56,61.21 LED7.C
  Bottom 1.27: Q5.2 62.23,73.91 60.33,73.91 I/O4.PWM
N$6
  Top 0.356: Q7.1 12.95,19.3 16.76,15.49 RL2.2
N$7
  Bottom 0.406: I/O3.I/O 45.09,80.9 53.98,80.9 R33.2
N$9  (2 unrouted)
N$10  (2 unrouted)
N$11  (1 unrouted)
N$12
  Top 0.356: 5V-OK.A RL4.2
N$13
  Top 0.406: R2.2 54.52,21.78 IC2.1
N$14
  Top 0.406: U$4.24 51.41,34.88 L1.1 50.44,32.15 C16.2
N$15
  Top 0.406: R2.1 54.52,26.98 IC2.8
N$16
  Top 0.356: U$4.6 54.61,51.31 54.1,51.31 C3.2
N$17
  Bottom 0.406: LED2.A 17.78,62.48 R25.1
N$18
  Bottom 0.406: I/O1.I/O 12.06,80.9 20.95,80.9 R.2
N$19
  Bottom 0.406: Q6.2 78.74,66.29 74.93,66.29 74.93,61.21 82.39,61.21 LED8.C
  Bottom 1.27: Q6.2 78.74,73.91 76.83,73.91 I/O5.PWM
N$20
  Top 0.356: 3.3V-OK.A R27.1
N$21  (2 unrouted)
N$22
  Bottom 0.406: LED6.A 50.8,62.48 R5.1
N$23  (1 unrouted)
N$24  (1 unrouted)
N$25  (1 unrouted)
N$26  (1 unrouted)
N$27  (1 unrouted)
N$28
  Bottom 0.406: Q2.2 29.21,66.29 25.4,66.29 25.4,61.21 32.54,61.21 LED5.C
  Bottom 1.27: Q2.2 29.21,73.91 27.3,73.91 I/O2.PWM
N$29
  Bottom 0.406: I/O4.I/O 61.59,80.9 70.48,80.9 R34.2
N$30
  Bottom 0.406: LED7.A 67.31,62.48 R6.1
N$31
  Top 0.406: R20.2 X1.2
N$32
  Bottom 0.406: I/O5.I/O 78.11,80.9 87,80.9 R35.2
N$33
  Bottom 0.406: LED8.A 83.82,62.48 R7.1
N$34
  Bottom 0.406: Q1.2 12.7,66.29 8.89,66.29 8.89,61.21 16.03,61.21 LED2.C
  Bottom 1.27: Q1.2 12.7,73.91 10.79,73.91 I/O1.PWM
N$35
  Top 0.356: U$3.CFG 83.31,52.07 75.44,52.07 73.66,50.29 CFG.4
N$36
  Top 2.54: Q7.2 22.86,7.87 J7.2
N$37
  Top 0.406: R19.2 X1.3
N$40
  Top 0.406: R9.1 57.71,28.6 57.71,27.58 57.78,27.51 IC2.6
N$42  (via drill 0.5)  (1 unrouted)
  Top 0.305: v45.97,40.64 44.45,40.64 R13.2 44.2,40.64 43.18,39.62
  Top 0.356: C8.2 40.39,39.62 X3.P$2 40.64,39.62 43.18,39.62
  Bottom 0.305: v46.48,42.16 45.97,41.66 v45.97,40.64
N$75
  Top 0.356: 12V-OK.A RL3.1
RESET  (4 unrouted)
RX  (1 unrouted)
SCK  (2 unrouted)
SCL  (1 unrouted)
  Bottom 0.406: I2C.SCL 95.89,68.52 96.52,68.52 R28.2
SDA  (2 unrouted)
TX  (1 unrouted)
USB_N
  Top 0.305: 35.69,52.22 48.11,52.22 48.11,53.85 49.24,53.85 arc90 49.61,54.22 arc-90 50.49,55.09 50.83,55.09 arc-90 51.7,54.22 arc90 52.07,53.85 52.82,53.85 arc90 53.19,54.22 arc-90 54.07,55.09 54.38,55.09 arc-90 55.26,54.22 arc90 55.63,53.85
  Top 0.356: R31.1 35.69,52.22 | 55.63,53.85 57.01,53.85 U$4.3
USB_P
  Top 0.305: 48.62,50.39 48.62,53.34 49.24,53.34 arc90 50.12,54.22 arc-90 50.49,54.33 50.32,54.33 arc-90 51.19,54.22 arc90 52.07,53.34 52.82,53.34 arc90 53.7,54.22 arc-90 54.07,54.58 54.38,54.58 arc-90 54.75,54.22 arc90 55.63,53.34
  Top 0.356: R24.1 35.69,50.39 48.62,50.39 | 55.63,53.34 56.21,53.34 U$4.4
USBC_N
  Top 0.406: X4.2 30.92,51.85 32.54,52.96 R31.2
USBC_P
  Top 0.406: X4.3 12.06,51.05 31.22,51 R24.2
VUSB  (via drill 0.5 pad 0.41)
  Top 0.61: v10.97,52.78 8.21,52.78 X4.1 | D4.A 20.57,42.06 20.32,41.81 20.32,48.31 v18.69,49.94 31.29,49.94 31.29,47.9 37.39,47.9 37.39,49.53 49.17,49.53 49.17,49.94 53.81,49.94 U$4.7
  Bottom 0.61: v10.97,52.78 11.1,52.66 C7.2 15.97,52.66 v18.69,49.94
XTAL1  (1 unrouted)
  Top 0.305: 44.96,42.93 44.45,43.43 R13.1 44.2,43.69 43.18,44.7 40.64,44.7
  Top 0.356: C2.2 40.39,44.7 X3.P$1 40.64,44.7

### Text on the board
tNames: 1
bNames: TX/RX
tValues: GND | DAT | Tliquid | 5V | PID | Weight | Tplate | 5V | - | + | GND | 5V | DAT | GND
bValues: BioReactor | Integrated Bertha v1.1 / Control Board
203bmp: C:/Users/G/Pictures/logo_epfl.bmp